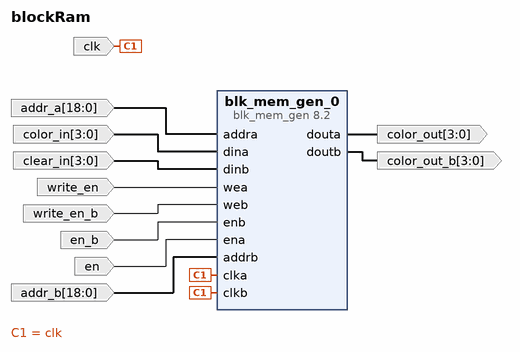
[diagram p0: block diagram of the top level]
# Vivado block design blockRam, Vivado 2015.2
create_bd_design blockRam

create_bd_port -dir I -from 18 -to 0 addr_a
create_bd_port -dir O -from 3 -to 0 color_out
create_bd_port -dir I clk
create_bd_port -dir I -from 3 -to 0 color_in
create_bd_port -dir I -from 3 -to 0 clear_in
create_bd_port -dir I write_en
create_bd_port -dir I write_en_b
create_bd_port -dir I en_b
create_bd_port -dir I en
create_bd_port -dir I -from 18 -to 0 addr_b
create_bd_port -dir O -from 3 -to 0 color_out_b

create_bd_cell -type ip -vlnv xilinx.com:ip:blk_mem_gen:8.2 blk_mem_gen_0
set_property -dict [list \
  CONFIG.Memory_Type True_Dual_Port_RAM \
  CONFIG.Enable_32bit_Address false \
  CONFIG.Use_Byte_Write_Enable false \
  CONFIG.Write_Width_A 4 \
  CONFIG.Write_Depth_A 307200 \
  CONFIG.Read_Width_A 4 \
  CONFIG.Operating_Mode_A READ_FIRST \
  CONFIG.Write_Width_B 4 \
  CONFIG.Read_Width_B 4 \
  CONFIG.Enable_B Use_ENB_Pin \
  CONFIG.Register_PortA_Output_of_Memory_Primitives true \
  CONFIG.Register_PortB_Output_of_Memory_Primitives true \
  CONFIG.Fill_Remaining_Memory_Locations false \
  CONFIG.Use_RSTA_Pin false \
  CONFIG.Port_B_Clock 100 \
  CONFIG.Port_B_Write_Rate 50 \
  CONFIG.Port_B_Enable_Rate 100 \
  CONFIG.use_bram_block Stand_Alone \
] [get_bd_cells blk_mem_gen_0]

# ---- connections ----

connect_bd_net [get_bd_ports addr_a] [get_bd_pins blk_mem_gen_0/addra]
connect_bd_net [get_bd_pins blk_mem_gen_0/douta] [get_bd_ports color_out]
connect_bd_net [get_bd_ports clk] [get_bd_pins blk_mem_gen_0/clka] [get_bd_pins blk_mem_gen_0/clkb]
connect_bd_net -net color_1 [get_bd_ports color_in] [get_bd_pins blk_mem_gen_0/dina]
connect_bd_net [get_bd_ports clear_in] [get_bd_pins blk_mem_gen_0/dinb]
connect_bd_net [get_bd_ports write_en] [get_bd_pins blk_mem_gen_0/wea]
connect_bd_net [get_bd_ports write_en_b] [get_bd_pins blk_mem_gen_0/web]
connect_bd_net [get_bd_ports en_b] [get_bd_pins blk_mem_gen_0/enb]
connect_bd_net [get_bd_ports en] [get_bd_pins blk_mem_gen_0/ena]
connect_bd_net [get_bd_ports addr_b] [get_bd_pins blk_mem_gen_0/addrb]
connect_bd_net [get_bd_pins blk_mem_gen_0/doutb] [get_bd_ports color_out_b]

validate_bd_design
save_bd_design
